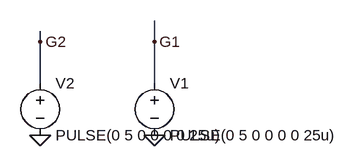
[diagram p0: schematic Draft1.asc]
Draft1.asc, the LTspice schematic file:
Version 4
SHEET 1 880 680
WIRE 32 80 32 64
WIRE 208 80 208 48
WIRE 32 144 32 80
WIRE 208 144 208 80
FLAG 32 224 0
FLAG 208 224 0
FLAG 208 80 G1
FLAG 32 80 G2
SYMBOL voltage 208 128 R0
WINDOW 123 0 0 Left 0
WINDOW 39 0 0 Left 0
SYMATTR InstName V1
SYMATTR Value PULSE(0 5 0 0 0 0 25u)
SYMBOL voltage 32 128 R0
WINDOW 123 0 0 Left 0
WINDOW 39 0 0 Left 0
SYMATTR InstName V2
SYMATTR Value PULSE(0 5 0 0 0 0 25u)

The netlist it stands for:
* Draft1.asc
V1 G1 0 PULSE(0 5 0 0 0 0 25u)
V2 G2 0 PULSE(0 5 0 0 0 0 25u)
.backanno
.end